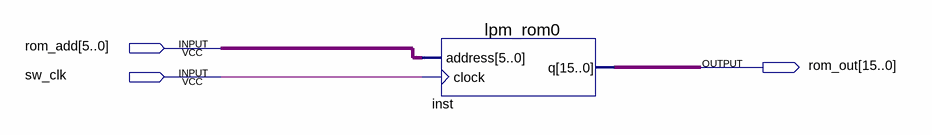
[diagram p0: schematic sheet]
// Quartus schematic ROM.bdf as structural Verilog: 1 symbols, 3 pins
module ROM (
  input  [5:0] rom_add,
  input  sw_clk,
  output [15:0] rom_out
);

  lpm_rom0 inst (.address(rom_add), .clock(sw_clk), .q(rom_out));
endmodule
